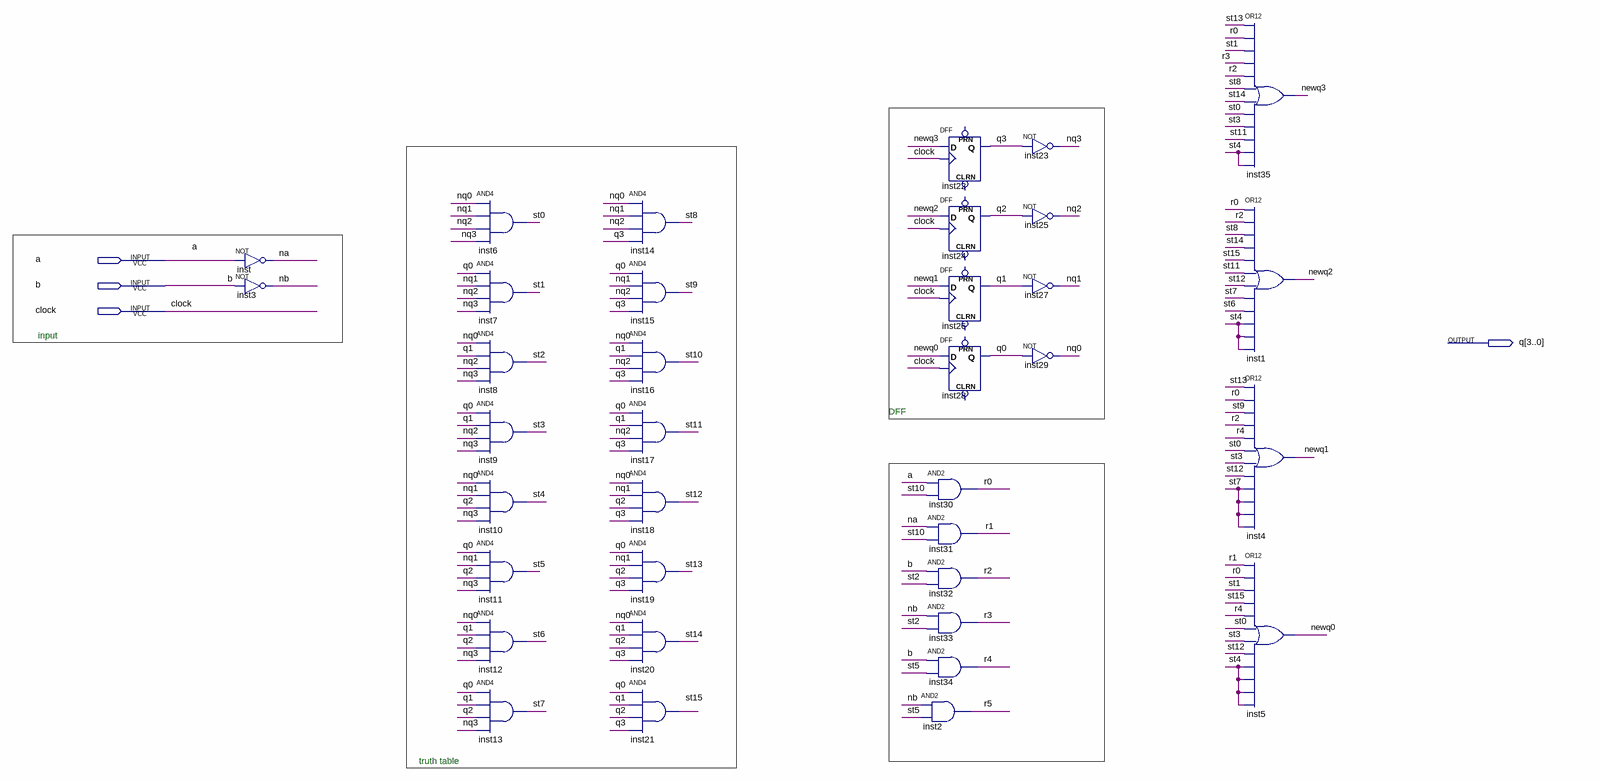
[diagram p0: schematic sheet]
// Quartus schematic lab311.bdf as structural Verilog: 36 symbols, 4 pins
module lab311 (
  input  a,
  input  b,
  input  clock,
  output [3:0] q
);

  wire na, nb, newq0, newq1, newq2, newq3, nq0, nq1, nq2, nq3, r0, r1, r2, r3, r4, r5, st0, st1, st2, st3,
       st4, st5, st6, st7, st8, st9, st10, st11, st12, st13, st14, st15;

  not inst (na, a);
  not inst3 (nb, b);
  and inst6 (st0, nq0, nq1, nq2, nq3);
  and inst7 (st1, q[0], nq1, nq2, nq3);
  and inst8 (st2, nq0, q[1], nq2, nq3);
  and inst9 (st3, q[0], q[1], nq2, nq3);
  and inst10 (st4, nq0, nq1, q[2], nq3);
  and inst11 (st5, q[0], nq1, q[2], nq3);
  and inst12 (st6, nq0, q[1], q[2], nq3);
  and inst13 (st7, q[0], q[1], q[2], nq3);
  and inst14 (st8, nq0, nq1, nq2, q[3]);
  and inst15 (st9, q[0], nq1, nq2, q[3]);
  and inst16 (st10, nq0, q[1], nq2, q[3]);
  and inst17 (st11, q[0], q[1], nq2, q[3]);
  and inst18 (st12, nq0, nq1, q[2], q[3]);
  and inst19 (st13, q[0], nq1, q[2], q[3]);
  and inst20 (st14, nq0, q[1], q[2], q[3]);
  and inst21 (st15, q[0], q[1], q[2], q[3]);
  and inst2 (r5, nb, st5);
  DFF inst22 (.CLK(clock), .D(newq3), .Q(q[3]));  // open: CLRN, PRN
  DFF inst24 (.CLK(clock), .D(newq2), .Q(q[2]));  // open: CLRN, PRN
  DFF inst26 (.CLK(clock), .D(newq1), .Q(q[1]));  // open: CLRN, PRN
  DFF inst28 (.CLK(clock), .D(newq0), .Q(q[0]));  // open: CLRN, PRN
  and inst30 (r0, a, st10);
  and inst31 (r1, na, st10);
  and inst32 (r2, b, st2);
  and inst33 (r3, nb, st2);
  and inst34 (r4, b, st5);
  not inst23 (nq3, q[3]);
  not inst25 (nq2, q[2]);
  not inst27 (nq1, q[1]);
  not inst29 (nq0, q[0]);
  or inst35 (newq3, st13, r0, st1, r3, r2, st8, st14, st0, st3, st11, st4, st4);
  or inst1 (newq2, r0, r2, st8, st14, st15, st11, st12, st7, st6, st4, st4, st4);
  or inst4 (newq1, st13, r0, st9, r2, r4, st0, st3, st12, st7, st7, st7, st7);
  or inst5 (newq0, r1, r0, st1, st15, r4, st0, st3, st12, st4, st4, st4, st4);

  // Notes on the sheet:
  //   input
  //   DFF
  //   truth table
endmodule
